# Altium schematic sheet DownStream.SchDoc
size 279 x 248 mm; SheetNumber: 1; SheetTotal: 4
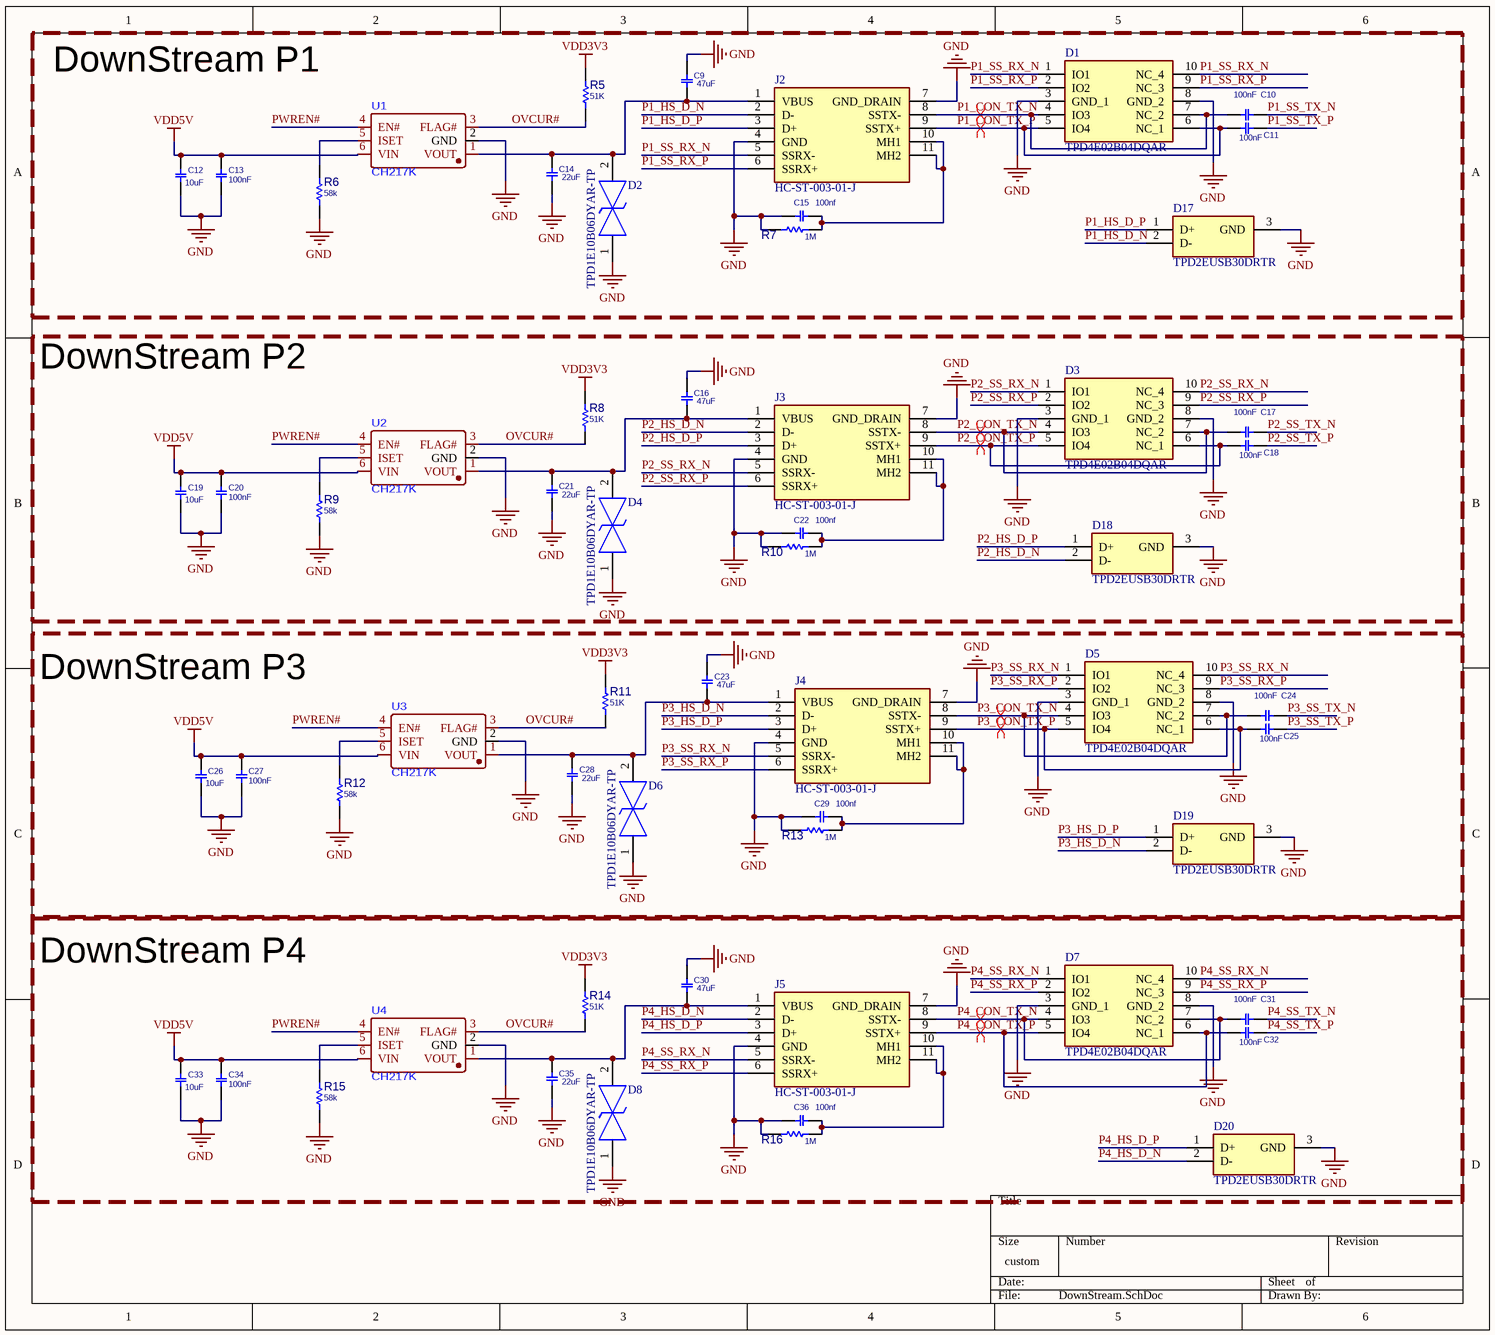
[diagram p0: DownStream.SchDoc]

## Parts
C9  47uF  [C0805]
C10  100nF  [C0402]
C11  100nF  [C0402]
C12  10uF  [C0603]
C13  100nF  [C0402]
C14  22uF  [C0805]
C15  100nf  [C1812]
C16  47uF  [C0805]
C17  100nF  [C0402]
C18  100nF  [C0402]
C19  10uF  [C0603]
C20  100nF  [C0402]
C21  22uF  [C0805]
C22  100nf  [C1812]
C23  47uF  [C0805]
C24  100nF  [C0402]
C25  100nF  [C0402]
C26  10uF  [C0603]
C27  100nF  [C0402]
C28  22uF  [C0805]
C29  100nf  [C1812]
C30  47uF  [C0805]
C31  100nF  [C0402]
C32  100nF  [C0402]
C33  10uF  [C0603]
C34  100nF  [C0402]
C35  22uF  [C0805]
C36  100nf  [C1812]
D1  TPD4E02B04DQAR  [DQA(R-PUSON-N10)]
D2  TPD1E10B06DYAR-TP  [SODFL1608X77N]
D3  TPD4E02B04DQAR  [DQA(R-PUSON-N10)]
D4  TPD1E10B06DYAR-TP  [SODFL1608X77N]
D5  TPD4E02B04DQAR  [DQA(R-PUSON-N10)]
D6  TPD1E10B06DYAR-TP  [SODFL1608X77N]
D7  TPD4E02B04DQAR  [DQA(R-PUSON-N10)]
D8  TPD1E10B06DYAR-TP  [SODFL1608X77N]
D17  TPD2EUSB30DRTR  [SOTFL35P100X50-3N]
D18  TPD2EUSB30DRTR  [SOTFL35P100X50-3N]
D19  TPD2EUSB30DRTR  [SOTFL35P100X50-3N]
D20  TPD2EUSB30DRTR  [SOTFL35P100X50-3N]
J2  HC-ST-003-01-J  [GSB4111312HR]
J3  HC-ST-003-01-J  [GSB4111312HR]
J4  HC-ST-003-01-J  [GSB4111312HR]
J5  HC-ST-003-01-J  [GSB4111312HR]
R5  51K  [R0402]
R6  58k  [R0402]
R7  1M  [R0805]
R8  51K  [R0402]
R9  58k  [R0402]
R10  1M  [R0805]
R11  51K  [R0402]
R12  58k  [R0402]
R13  1M  [R0805]
R14  51K  [R0402]
R15  58k  [R0402]
R16  1M  [R0805]
U1  CH217K  [IC_IC-DP_SOT23-6L]
U2  CH217K  [IC_IC-DP_SOT23-6L]
U3  CH217K  [IC_IC-DP_SOT23-6L]
U4  CH217K  [IC_IC-DP_SOT23-6L]

## Blocks framed on the sheet
DownStream P1: C9-C15 D1 D2 D17 J2 R5-R7 U1
DownStream P2: C16-C22 D3 D4 D18 J3 R8-R10 U2
DownStream P3: C23-C29 D5 D6 D19 J4 R11-R13 U3
DownStream P4: C30-C36 D7 D8 D20 J5 R14-R16 U4

## Nets
GND: C9.2 C12.1 C13.2 C14.1 C15.1 C16.2 C19.1 C20.2 C21.1 C22.1 C23.2 C26.1 C27.2 C28.1 C29.1 C30.2 C33.1 C34.2 C35.1 C36.1 D1.3(GND_1) D1.8(GND_2) D2.1 D3.3(GND_1) D3.8(GND_2) D4.1 D5.3(GND_1) D5.8(GND_2) D6.1 D7.3(GND_1) D7.8(GND_2) D8.1 D17.3(GND) D18.3(GND) D19.3(GND) D20.3(GND) J2.4(GND) J2.7(GND_DRAIN) J3.4(GND) J3.7(GND_DRAIN) J4.4(GND) J4.7(GND_DRAIN) J5.4(GND) J5.7(GND_DRAIN) R6.2 R7.2 R9.2 R10.2 R12.2 R13.2 R15.2 R16.2 U1.2(GND) U2.2(GND) U3.2(GND) U4.2(GND)
VDD3V3: R5.1 R8.1 R11.1 R14.1
VDD5V: C12.2 C13.1 C19.2 C20.1 C26.2 C27.1 C33.2 C34.1 U1.6(VIN) U2.6(VIN) U3.6(VIN) U4.6(VIN)
OVCUR#: R5.2 R8.2 R11.2 R14.2 U1.3(FLAG#) U2.3(FLAG#) U3.3(FLAG#) U4.3(FLAG#)
P1_CON_TX_N: C10.2 D1.4(IO3) D1.7(NC_2) J2.8(SSTX-)
P1_CON_TX_P: C11.2 D1.5(IO4) D1.6(NC_1) J2.9(SSTX+)
P1_HS_D_N: D17.2(D-) J2.2(D-)
P1_HS_D_P: D17.1(D+) J2.3(D+)
P1_SS_RX_N: D1.1(IO1) D1.10(NC_4) J2.5(SSRX-)
P1_SS_RX_P: D1.2(IO2) D1.9(NC_3) J2.6(SSRX+)
P1_SS_TX_N: C10.1
P1_SS_TX_P: C11.1
P2_CON_TX_N: C17.2 D3.4(IO3) D3.7(NC_2) J3.8(SSTX-)
P2_CON_TX_P: C18.2 D3.5(IO4) D3.6(NC_1) J3.9(SSTX+)
P2_HS_D_N: D18.2(D-) J3.2(D-)
P2_HS_D_P: D18.1(D+) J3.3(D+)
P2_SS_RX_N: D3.1(IO1) D3.10(NC_4) J3.5(SSRX-)
P2_SS_RX_P: D3.2(IO2) D3.9(NC_3) J3.6(SSRX+)
P2_SS_TX_N: C17.1
P2_SS_TX_P: C18.1
P3_CON_TX_N: C24.2 D5.4(IO3) D5.7(NC_2) J4.8(SSTX-)
P3_CON_TX_P: C25.2 D5.5(IO4) D5.6(NC_1) J4.9(SSTX+)
P3_HS_D_N: D19.2(D-) J4.2(D-)
P3_HS_D_P: D19.1(D+) J4.3(D+)
P3_SS_RX_N: D5.1(IO1) D5.10(NC_4) J4.5(SSRX-)
P3_SS_RX_P: D5.2(IO2) D5.9(NC_3) J4.6(SSRX+)
P3_SS_TX_N: C24.1
P3_SS_TX_P: C25.1
P4_CON_TX_N: C31.2 D7.4(IO3) D7.7(NC_2) J5.8(SSTX-)
P4_CON_TX_P: C32.2 D7.5(IO4) D7.6(NC_1) J5.9(SSTX+)
P4_HS_D_N: D20.2(D-) J5.2(D-)
P4_HS_D_P: D20.1(D+) J5.3(D+)
P4_SS_RX_N: D7.1(IO1) D7.10(NC_4) J5.5(SSRX-)
P4_SS_RX_P: D7.2(IO2) D7.9(NC_3) J5.6(SSRX+)
P4_SS_TX_N: C31.1
P4_SS_TX_P: C32.1
PWREN#: U1.4(EN#) U2.4(EN#) U3.4(EN#) U4.4(EN#)
NetC9_1: C9.1 C14.2 D2.2 J2.1(VBUS) U1.1(VOUT)
NetC15_2: C15.2 J2.10(MH1) J2.11(MH2) R7.1
NetC16_1: C16.1 C21.2 D4.2 J3.1(VBUS) U2.1(VOUT)
NetC22_2: C22.2 J3.10(MH1) J3.11(MH2) R10.1
NetC23_1: C23.1 C28.2 D6.2 J4.1(VBUS) U3.1(VOUT)
NetC29_2: C29.2 J4.10(MH1) J4.11(MH2) R13.1
NetC30_1: C30.1 C35.2 D8.2 J5.1(VBUS) U4.1(VOUT)
NetC36_2: C36.2 J5.10(MH1) J5.11(MH2) R16.1
NetR6_1: R6.1 U1.5(ISET)
NetR9_1: R9.1 U2.5(ISET)
NetR12_1: R12.1 U3.5(ISET)
NetR15_1: R15.1 U4.5(ISET)

## Layout directives
differential pair; net class SupperSpeed; rule Differential Pairs Routing [Pref Gap = 5mil    Min Gap  = 5mil    Max Gap  = 5milPref Width = 4.347mil    Min Width  = 2.255mil    Max Width  = 4.347mil]: P1_CON_TX_N, P1_CON_TX_P, P2_CON_TX_N, P2_CON_TX_P, P3_CON_TX_N, P3_CON_TX_P, P4_CON_TX_N, P4_CON_TX_P

## Library data of the parts
C9 C14 C16 C21 C23 C28 C30 C35 = CAP_SMD_MLCC_0805
C10 C11 C13 C17 C18 C20 C24 C25 C27 C31 C32 C34 = CAP_SMD_MLCC_0402
C12 C19 C33 = CAP_SMD_MLCC_0603: CAP, MLCC, -F, -V, MATERIAL, -%, 0201
C15 C22 C29 C36 = CAP_SMD_MLCC_1812: +1kv 100nf
C26 = CAP_SMD_MLCC_0603
D1 D3 D5 D7 = TPD4E02B04DQAR: Diode; Manufacturer_Name: Texas Instruments; Datasheet Link: http://www.ti.com/lit/gpn/tpd4e02b04; Manufacturer_Part_Number: TPD4E02B04DQAR; Mouser Part Number: 595-TPD4E02B04DQAR; Mouser Price/Stock: https://www.mouser.co.uk/ProductDetail/Texas-Instruments/TPD4E02B04DQAR?qs=8%2FmU9qzJpL%2FFVYtHO1iV9g%3D%3D; Arrow Part Number: TPD4E02B04DQAR; Arrow Price/Stock: https://www.arrow.com/en/products/tpd4e02b04dqar/texas-instruments?utm_currency=USD&region=nac
D2 D4 D6 D8 = TPD1E10B06DYARQ1: TVS Diode (Bi-directional); Manufacturer_Name: Texas Instruments; Datasheet Link: https://www.ti.com/lit/ds/symlink/tpd1e10b06-q1.pdf?ts=1647960520558&ref_url=https%253A%252F%252Fwww.ti.com%252Fstore%252Fti%252Fen%252Fp%252Fproduct%252F%253Fp%253DTPD1E10B06DYARQ1%2526keyMatch%253DTPD1E10B06DYARQ1%2526tisearch%253Dsearch-everything%2526; Height: 0.77mm; Manufacturer_Part_Number: TPD1E10B06DYARQ1; Mouser Part Number: 595-TPD1E10B06DYARQ1; Mouser Price/Stock: https://www.mouser.co.uk/ProductDetail/Texas-Instruments/TPD1E10B06DYARQ1?qs=MyNHzdoqoQLC7lMK0t36jg%3D%3D; Arrow Part Number: TPD1E10B06DYARQ1; Arrow Price/Stock: https://www.arrow.com/en/products/tpd1e10b06dyarq1/texas-instruments.html?utm_currency=USD&region=nac
D17-D20 = TPD2EUSB30DRTR: TPD2EUSB30ADRTR; Manufacturer_Name: Texas Instruments; Datasheet Link: https://datasheet.datasheetarchive.com/originals/distributors/SFDatasheet-11/sf-000234749.pdf; Height: 0.5mm; Manufacturer_Part_Number: TPD2EUSB30DRTR; Mouser Part Number: 595-TPD2EUSB30DRTR; Mouser Price/Stock: https://www.mouser.co.uk/ProductDetail/Texas-Instruments/TPD2EUSB30DRTR?qs=%2Fqzd9s%252BcLd6bPJi5HXCDvw%3D%3D; Arrow Part Number: TPD2EUSB30DRTR; Arrow Price/Stock: https://www.arrow.com/en/products/tpd2eusb30drtr/texas-instruments?utm_currency=USD&region=nac
J2-J5 = GSB4111312HR: Connector; Manufacturer_Name: HCTL; Datasheet Link: https://jlc-prod-smt.oss-eu-central-1.aliyuncs.com/smtDataManualFile/8588944600697987072-C2845330.pdf?response-content-disposition=attachment%3B%20filename%3DC2845330.pdf%3B%20filename%2A%3DUTF-8%27%27C2845330.pdf&x-oss-date=20260624T131613Z&x-oss-expires=1800&x-oss-security-token=CAISgAN1q6Ft5B2yfSjIr5neLuyMobBX8Jq8VFL3t04ybct22oPs1Tz2IHhMdHJsAOodtv0%2FmmhT6PkclqRLcbhpcmfjV%2BZHzLB8qfh56zJG4J7b16cNrbH4M4H6aXeirtuwDsz9SNTCALjPD3nPii50x5bjaDymRCbLGJaViJlhHLN1Ow6jdmhpCctxLAlvo9NgFxm3D%2Fu2NQPwiWf9FVdhvhEG6Vly8qOi2MaRmFy8yFTx0b0SvJ%2BjYMrmPctoN9JnSdC5mfdzau3a1TJ84gRD0a5wkaVA1zbDs5bfISEIuUzebreLqY03dV4mOvdqIcMe8qigz88fk%2FfIioH6xyxKOexoSCnFTOiiupCcQLPyao9jLu6iayqViY7QaIOTqQohZmkAMwVOasAsI3Ngh4zF97Qt0cVNkXO9gWfLI8DtuMleWmrhyvhZYnSgc5lCkRRYwGs1287ugXlSQzo890KPDAEovaKCnZ2ZSfh7Y4sNknI6i%2Bfc2Se2MIkIaGg6%2BaKWD5sagAGaU2vJ%2BUbHVcuInMWet0dEX2Iv7ftV1FJ3rlSjwZii9OyhGbJCZVYvIkQRaKGMI1tb%2BXiUsWCR1GdB305w4Pj9RGYZ3q2pJnyDZ5Gd2q%2FQL%2Byrus7VegFb%2FfVgXDtlbRo3gaGxstKJLtvMuu%2FTomt3hknP3Pb5omGW5yvr9zftiSAA&x-oss-signature-version=OSS4-HMAC-SHA256&x-oss-credential=STS.NZkeV8LovGXWVtFSNgaDZ5FG7%2F20260624%2Feu-central-1%2Foss%2Faliyun_v4_request&x-oss-signature=348679cb6c752d500094aba1cae5179e4d919bc3f1e2f01c465e7868dab20983; Height: 7.94mm; Manufacturer_Part_Number: HC-ST-003-01-J
R5-R16 = RES_SMD_0402: RESISTOR, SMD